# Altium schematic sheet ACK_2_Sheet6.SchDoc
size 209 x 297 mm; CheckedBy: Бондарчук ПС; Author: Ільницька ЛЛ; CompanyName: ТОВ "Радіонікс"; SheetNumber: 1; SheetTotal: 1; ЕСКД_Децимальний_номер: ААЭД.426439.xxx Э3; ЕСКД_Назва_схеми_1: Схема електрична; ЕСКД_Назва_схеми_2: принципова; ЕСКД_Лист: 1; ЕСКД_Листів: 1; ЕСКД_Назва_пристрою_2: Клавіатура; ЕСКД_Організація: ТОВ "Радіонікс"; PageSetup: Record=PageOptions|CenterHorizontal=True|CenterVertical=True|PrintScale=0.94|XCorrection=1.00|YCorrection=1.00|PrintKind=1|BorderSize=5000000|LeftOffset=0|BottomOffset=0|Orientation=1|PaperLength=1000|PaperWidth=1000|Scale=100|PaperSource=7|PrintQuality=-4|MediaType=1|DitherType=10|PrintScaleMode=1|PaperKind=A4; DecimalNumber: АЧАД.426439.xxx Э3; HeadOfSector: Нач. сектора; MainDevice: Перв.примен.; Name: Клавіатура АСК-2
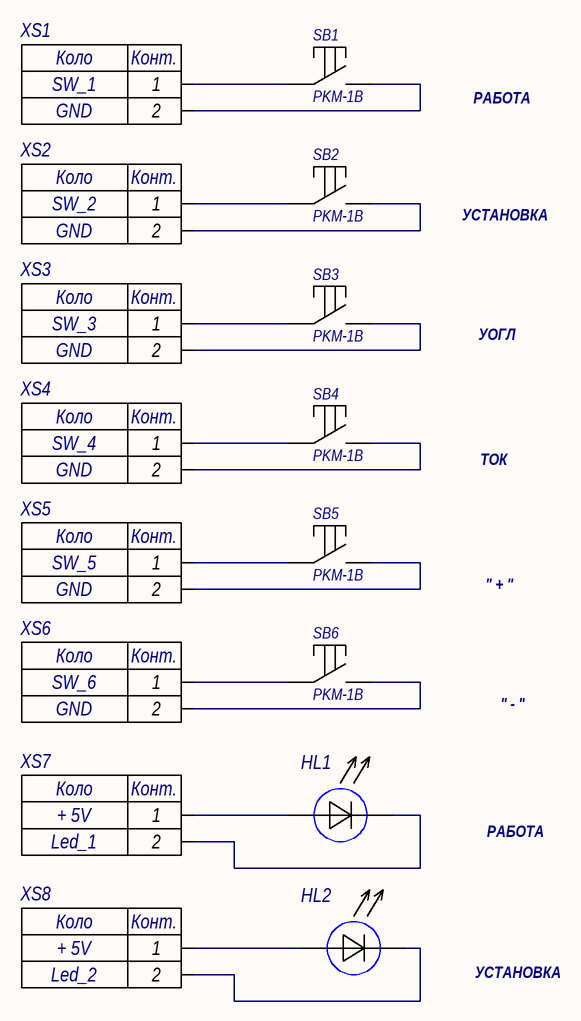
[diagram p0: ACK_2_Sheet6.SchDoc]

## Parts
HL1  LED_1  [LED_VISHAY_VLMX1]  (value not drawn)
HL2  LED_1  [LED_VISHAY_VLMX1]  (value not drawn)
SB1  PKM-1B
SB2  PKM-1B
SB3  PKM-1B
SB4  PKM-1B
SB5  PKM-1B
SB6  PKM-1B
XS1  M20-9770242  (value not drawn)
XS2  M20-9770242  (value not drawn)
XS3  M20-9770242  (value not drawn)
XS4  M20-9770242  (value not drawn)
XS5  M20-9770242  (value not drawn)
XS6  M20-9770242  (value not drawn)
XS7  M20-9770242  (value not drawn)
XS8  M20-9770242  (value not drawn)

## Nets
NetHL1_1: HL1.1 XS7.1
NetHL1_2: HL1.2 XS7.2
NetHL2_1: HL2.1 XS8.1
NetHL2_2: HL2.2 XS8.2
NetSB1_1: SB1.1 XS1.1
NetSB1_2: SB1.2 XS1.2
NetSB2_1: SB2.1 XS2.1
NetSB2_2: SB2.2 XS2.2
NetSB3_1: SB3.1 XS3.1
NetSB3_2: SB3.2 XS3.2
NetSB4_1: SB4.1 XS4.1
NetSB4_2: SB4.2 XS4.2
NetSB5_1: SB5.1 XS5.1
NetSB5_2: SB5.2 XS5.2
NetSB6_1: SB6.1 XS6.1
NetSB6_2: SB6.2 XS6.2

## Notes on the sheet
- SW_1
- GND
- РАБОТА
- SW_2
- УСТАНОВКА
- SW_3
- УОГЛ
- SW_4
- ТОК
- SW_5
- " + "
- SW_6
- " - "
- Led_1
- + 5V
- Led_2
- Перв.примен.
- Справ.№
- Подп. и дата
- Инв.№ дубл.
- Взам.инв.№
- Подп.и дата
- Разраб.
- Изм.
- Лист
- № докум.
- Подп.
- Дата
- Лит.
- Масштаб
- Масса
- Т.контр.
- Пров.
- СХЕМА   ЕЛЕКТРИЧНА
- ПРИНЦИПОВА
- Листов
- Инв.№ подл.
- Утв.
- Н.контр.
- Нач.сект.
- Копировал
- Формат  A4
- (in symbol M20-9770242) Коло; Конт.